# EAGLE schematic Jupiter Ace build023 (EAGLE 9.6.2)
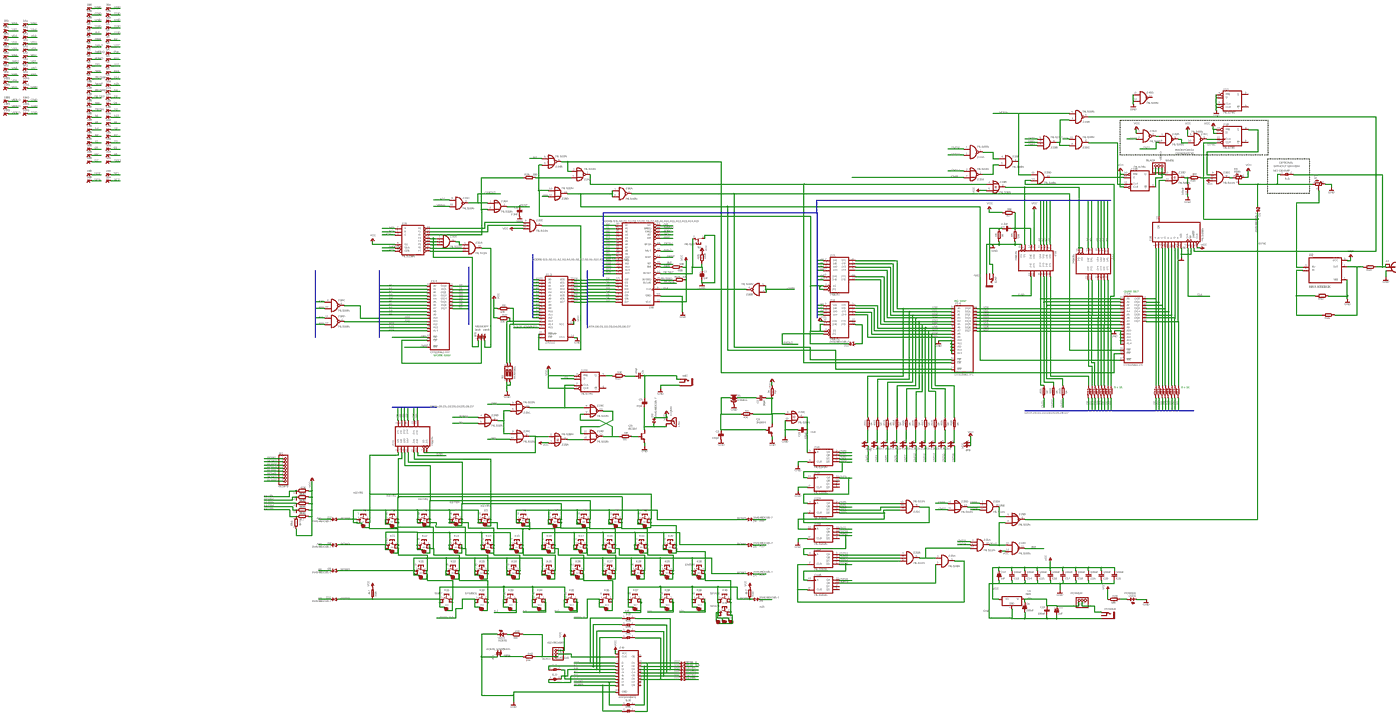
[diagram p0: schematic, sheet 1, overview]
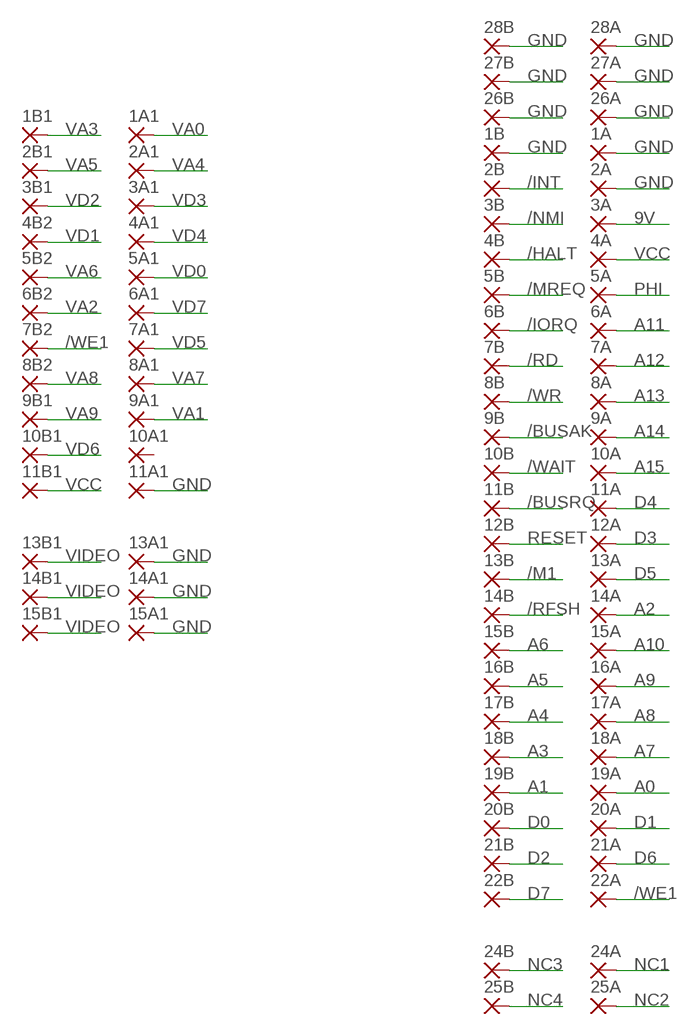
[diagram p1: schematic, sheet 1, part 1 of 5]
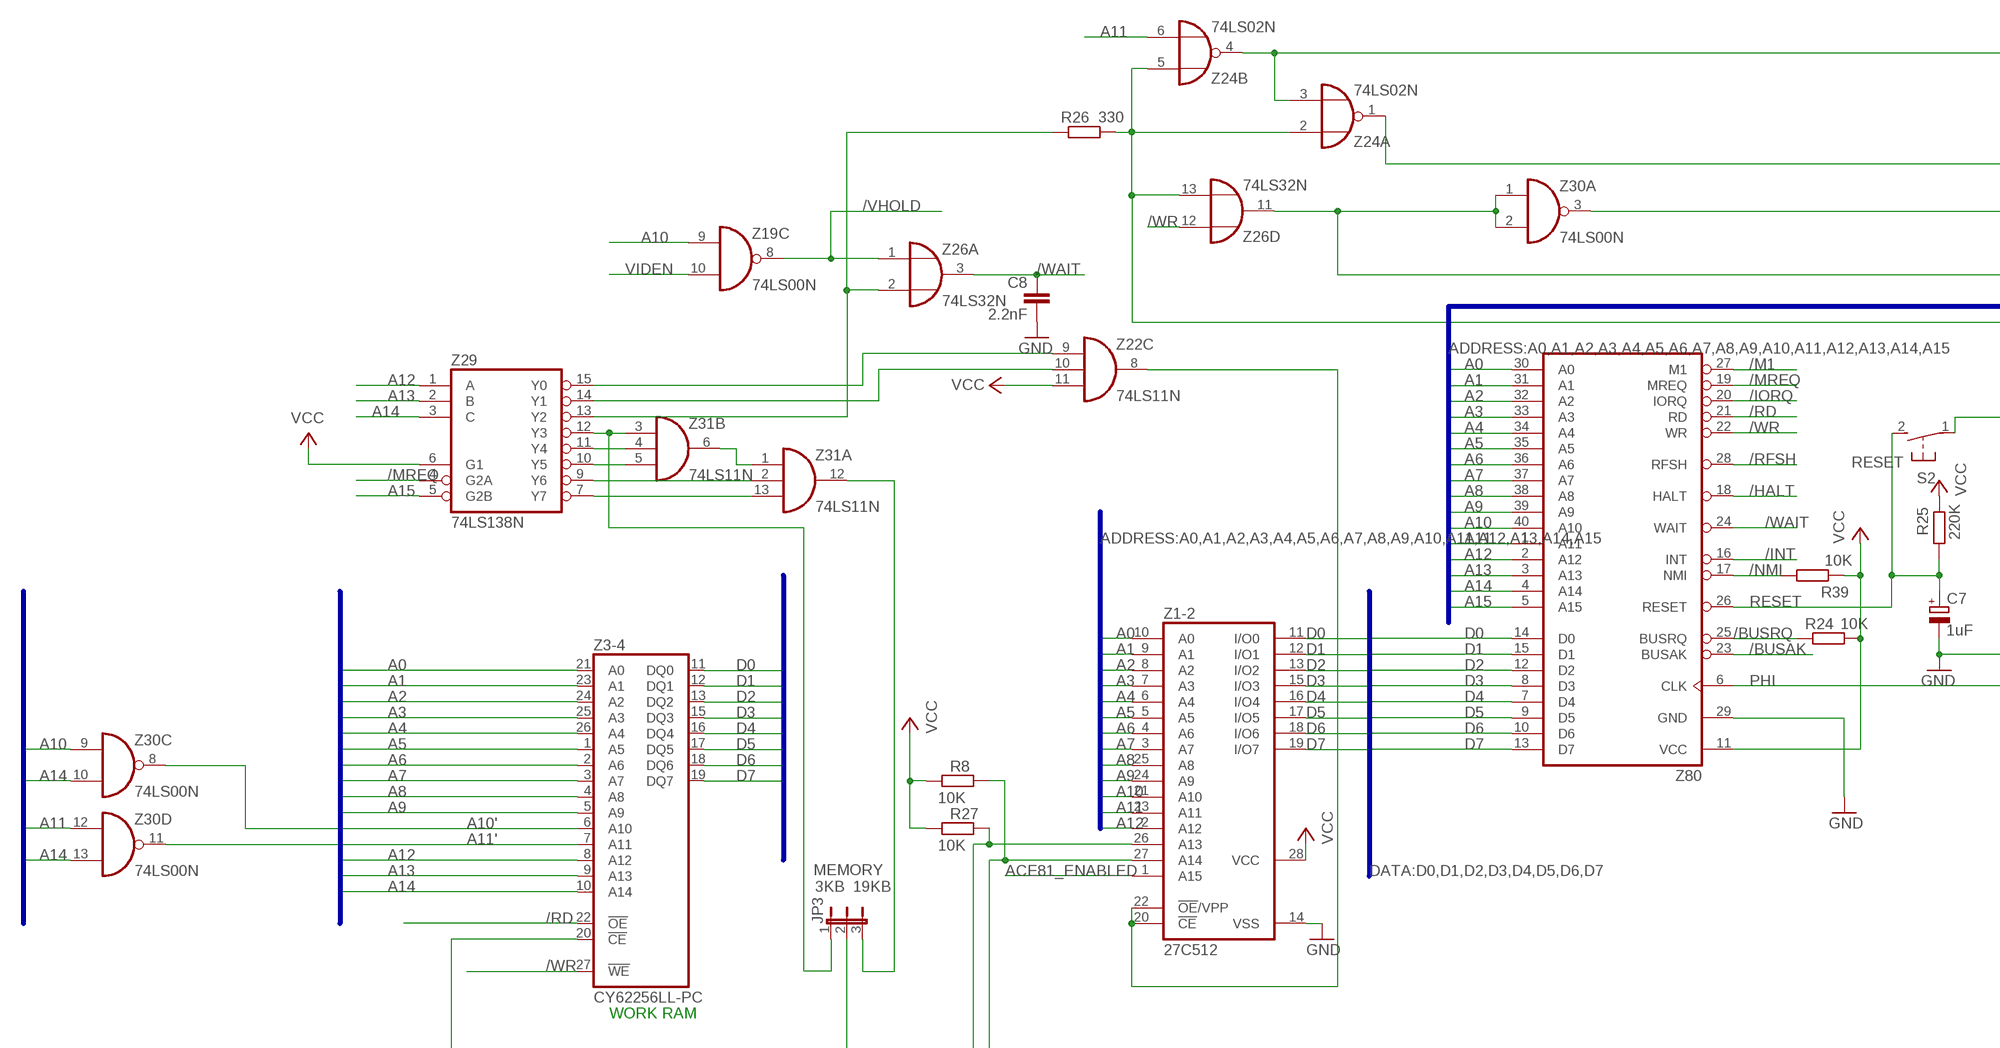
[diagram p2: schematic, sheet 1, part 2 of 5]
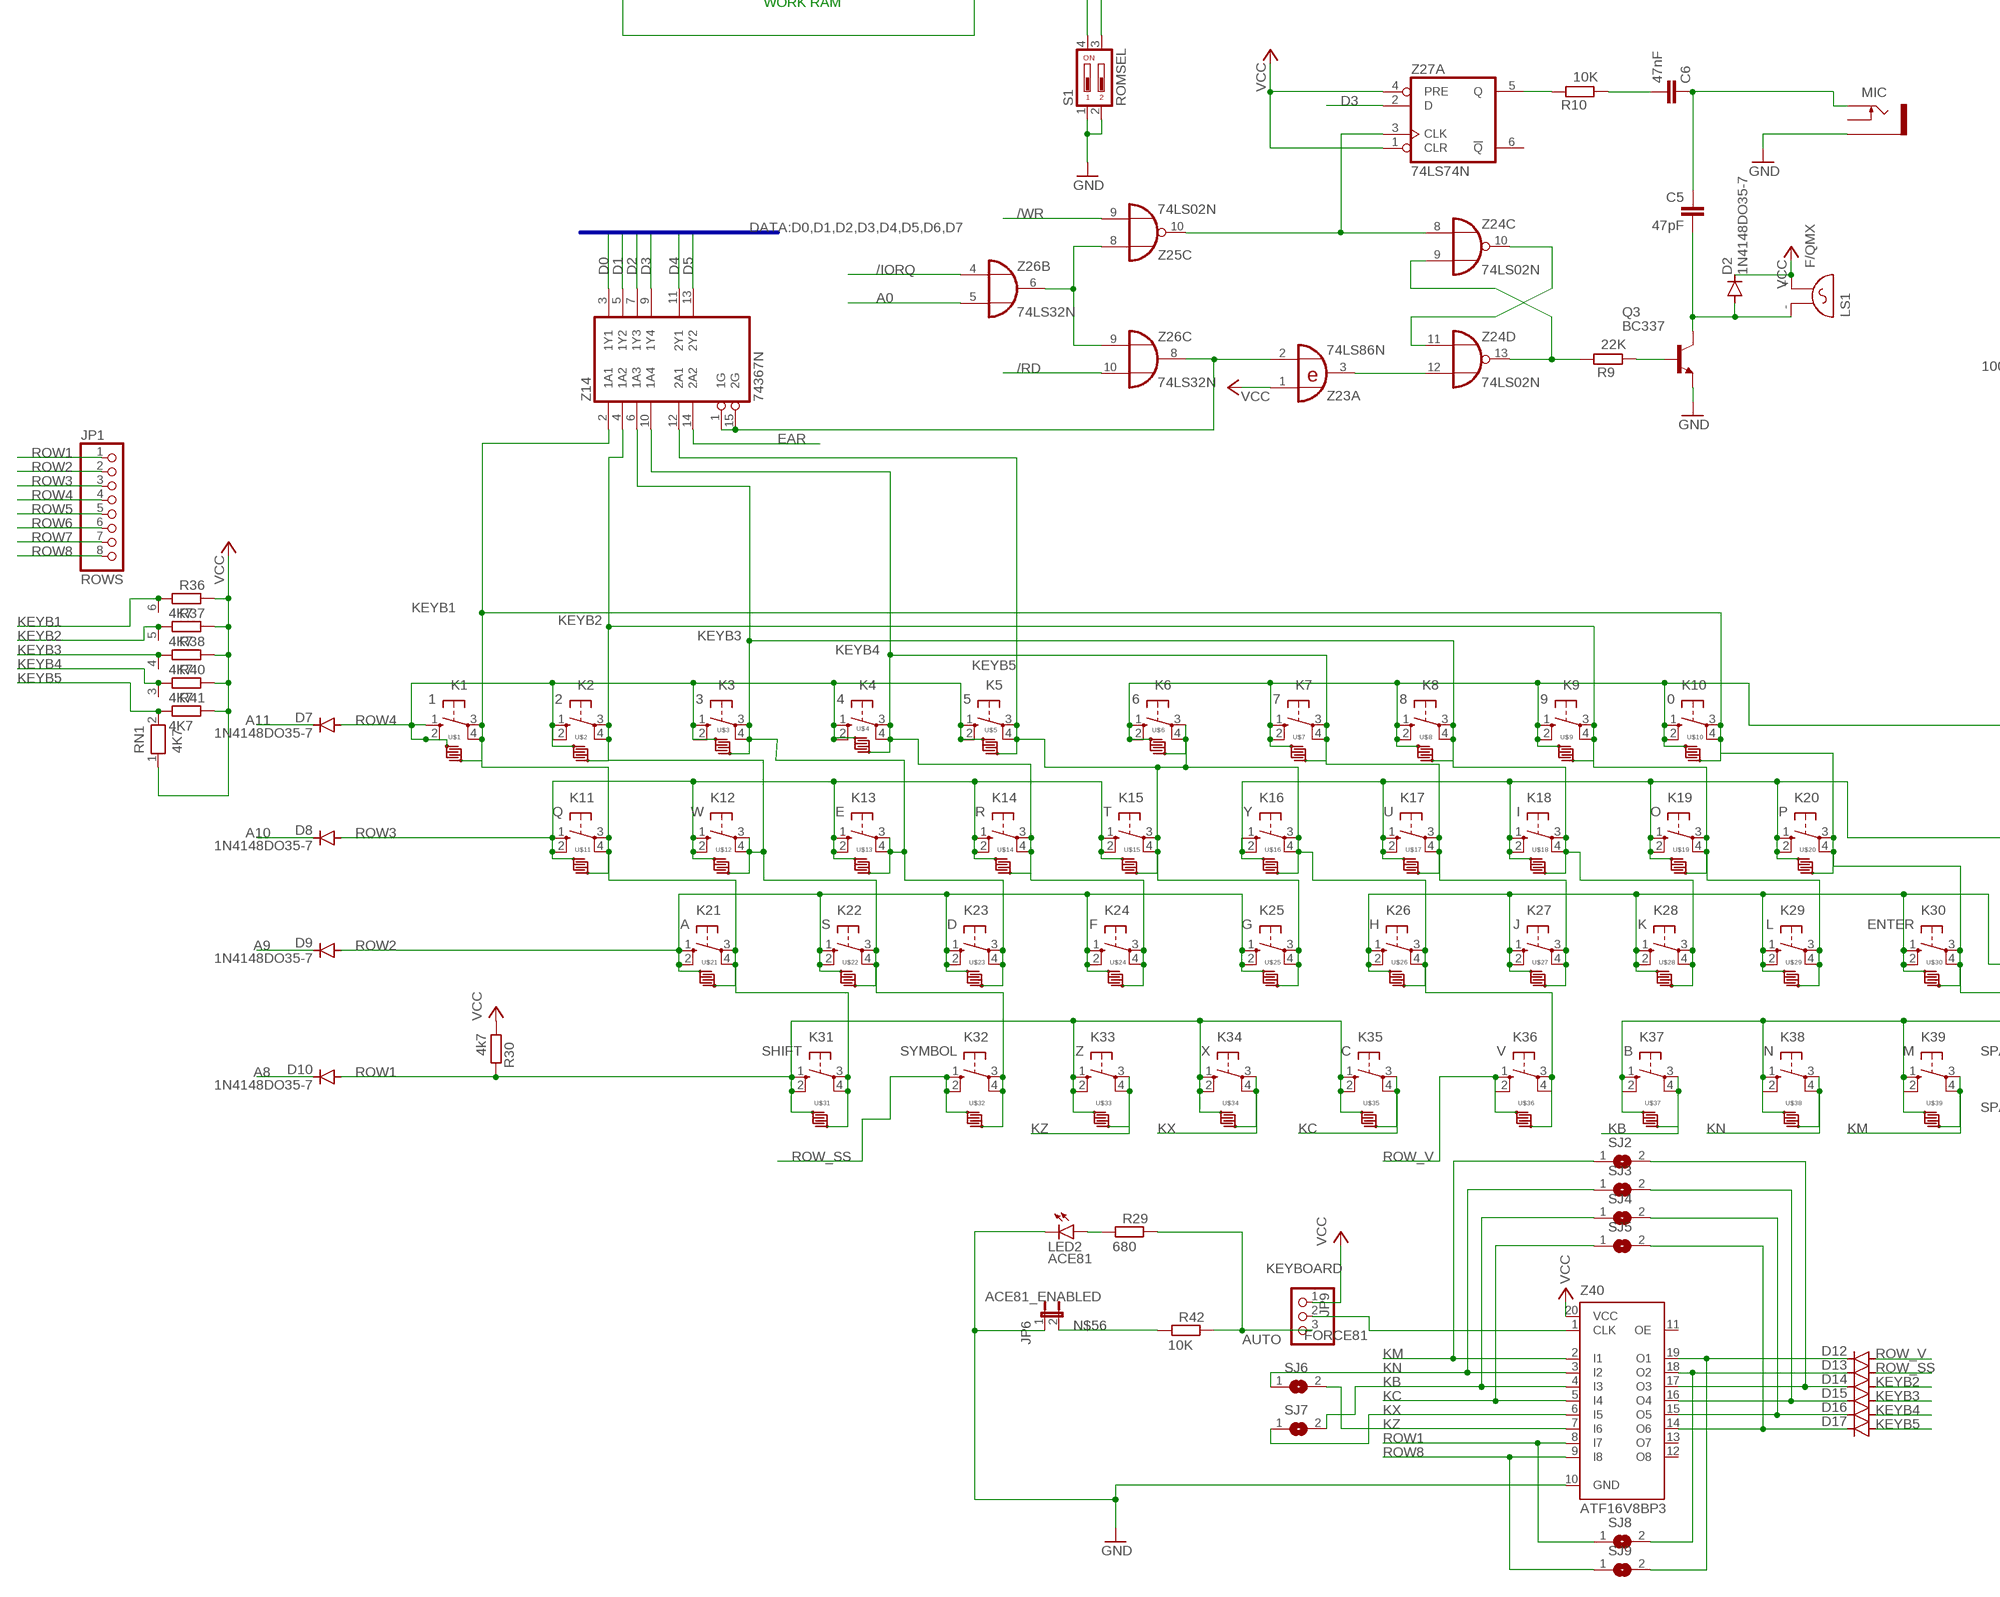
[diagram p3: schematic, sheet 1, part 3 of 5]
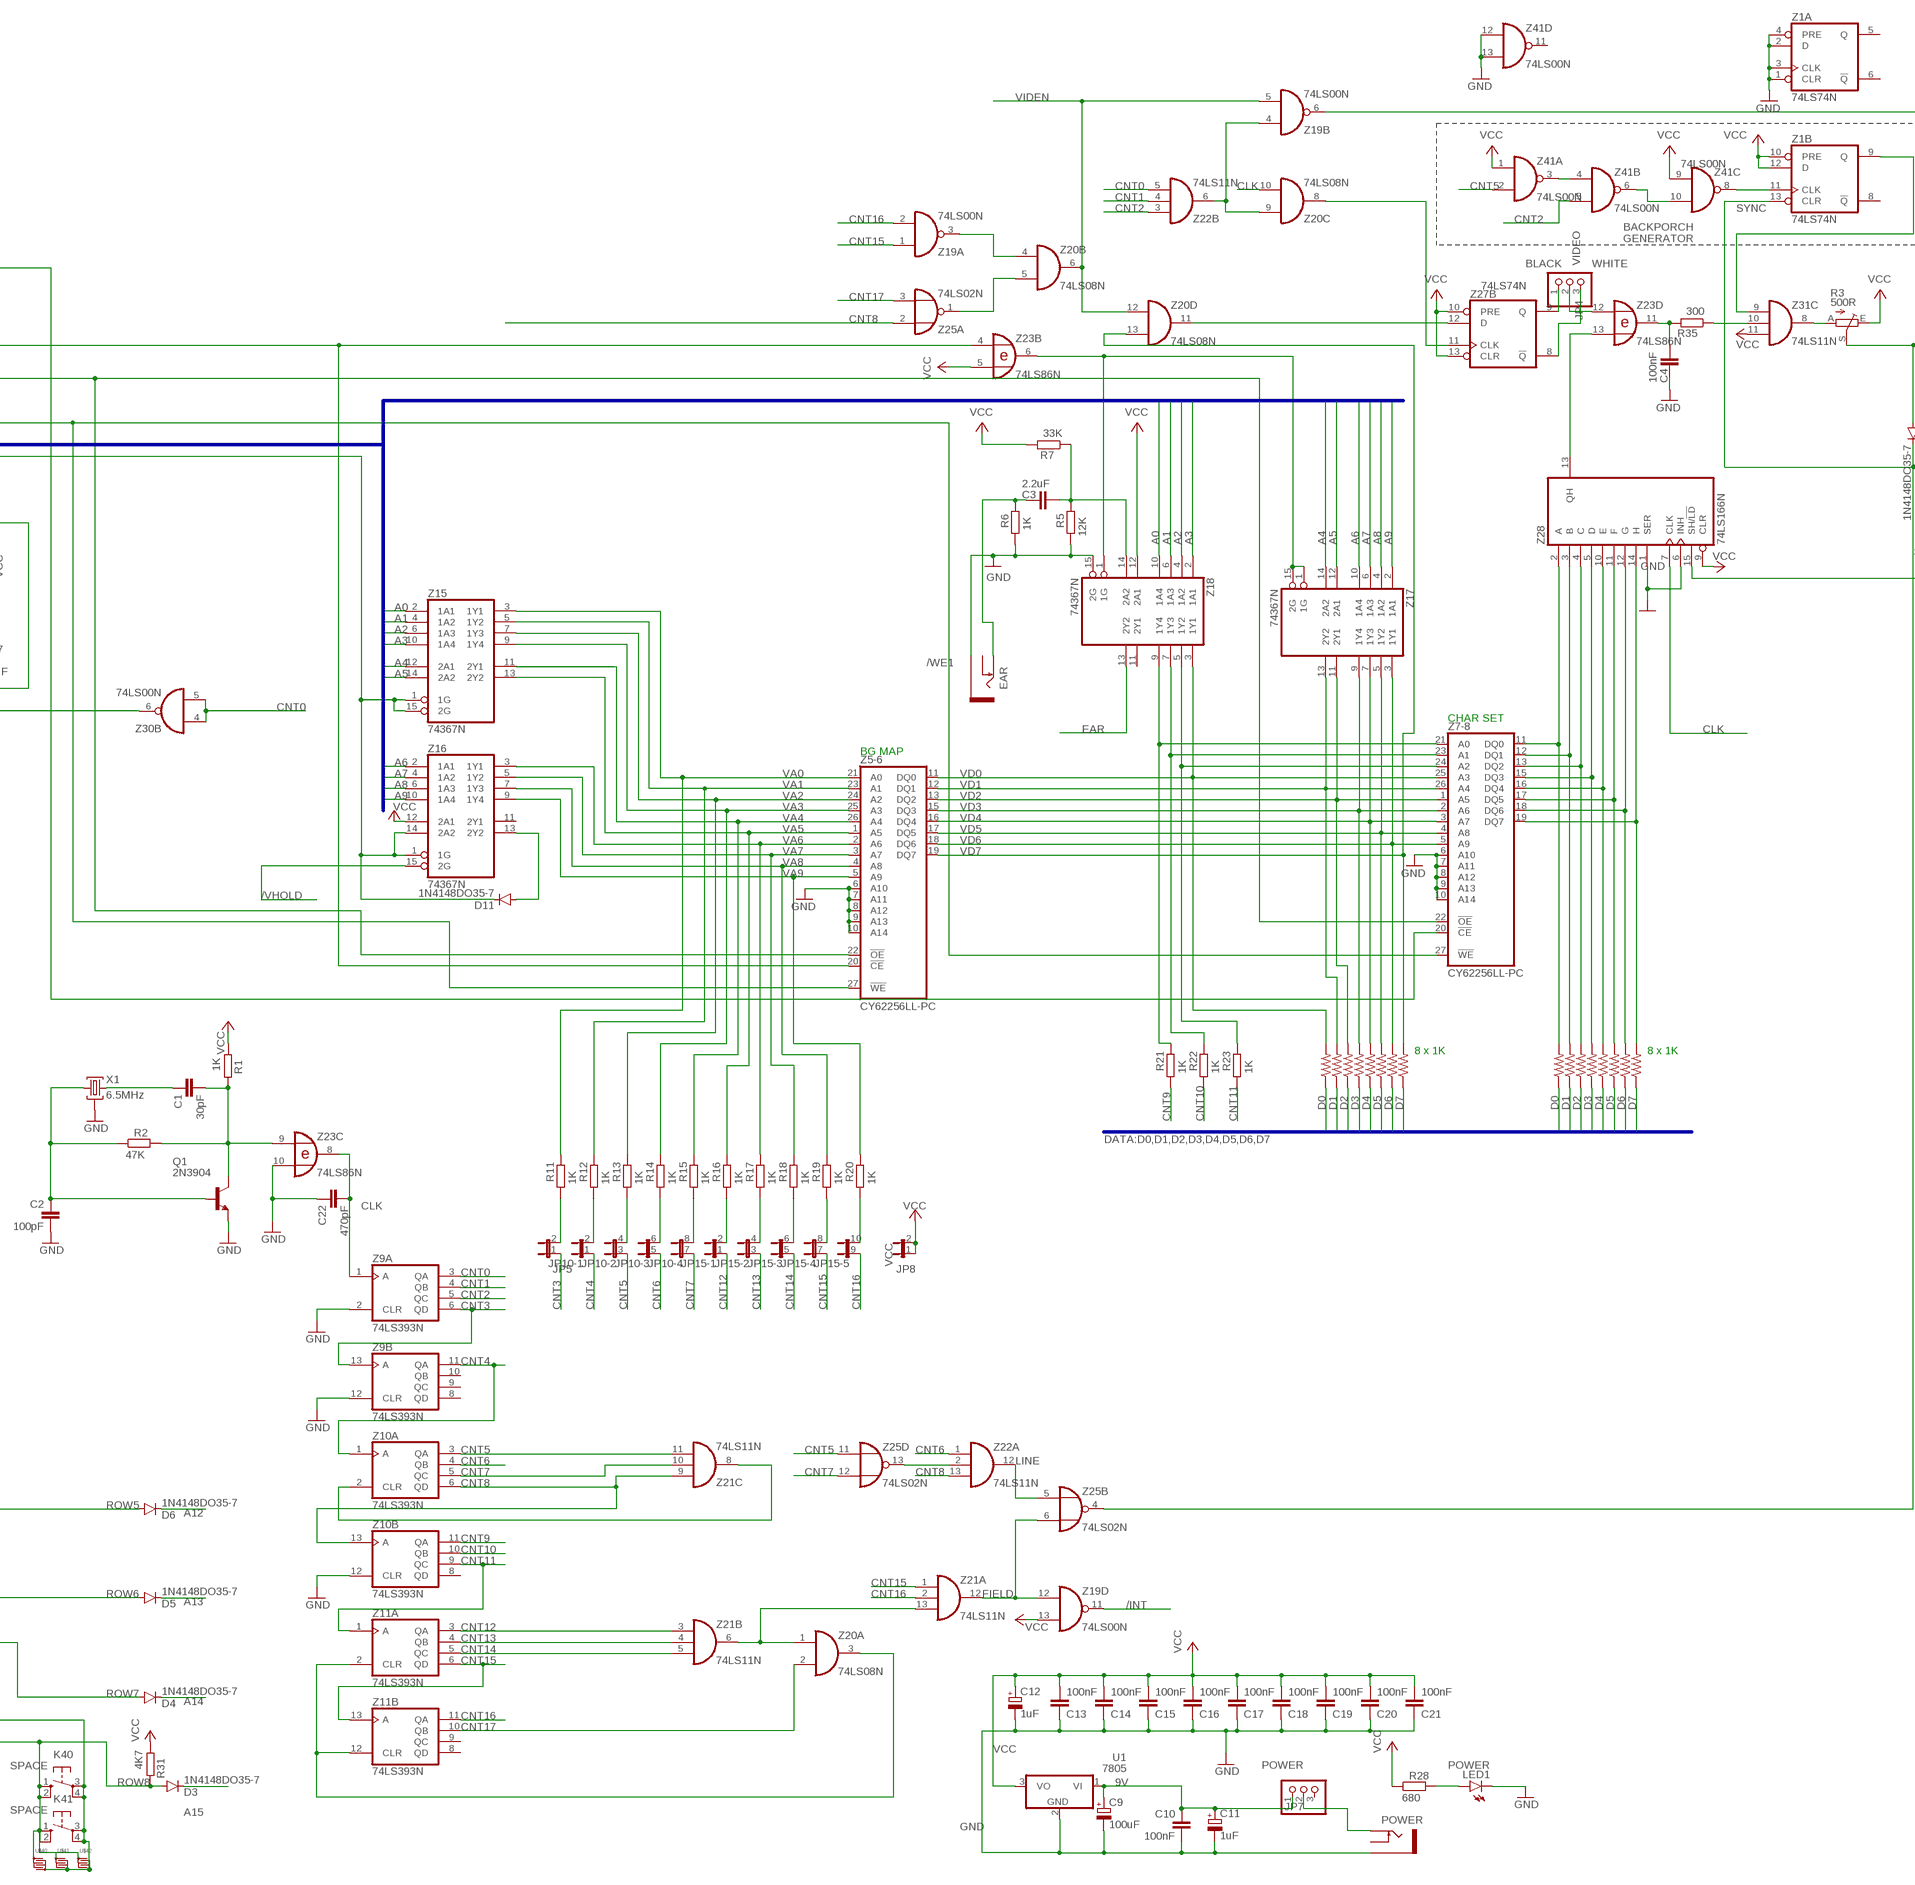
[diagram p4: schematic, sheet 1, part 4 of 5]
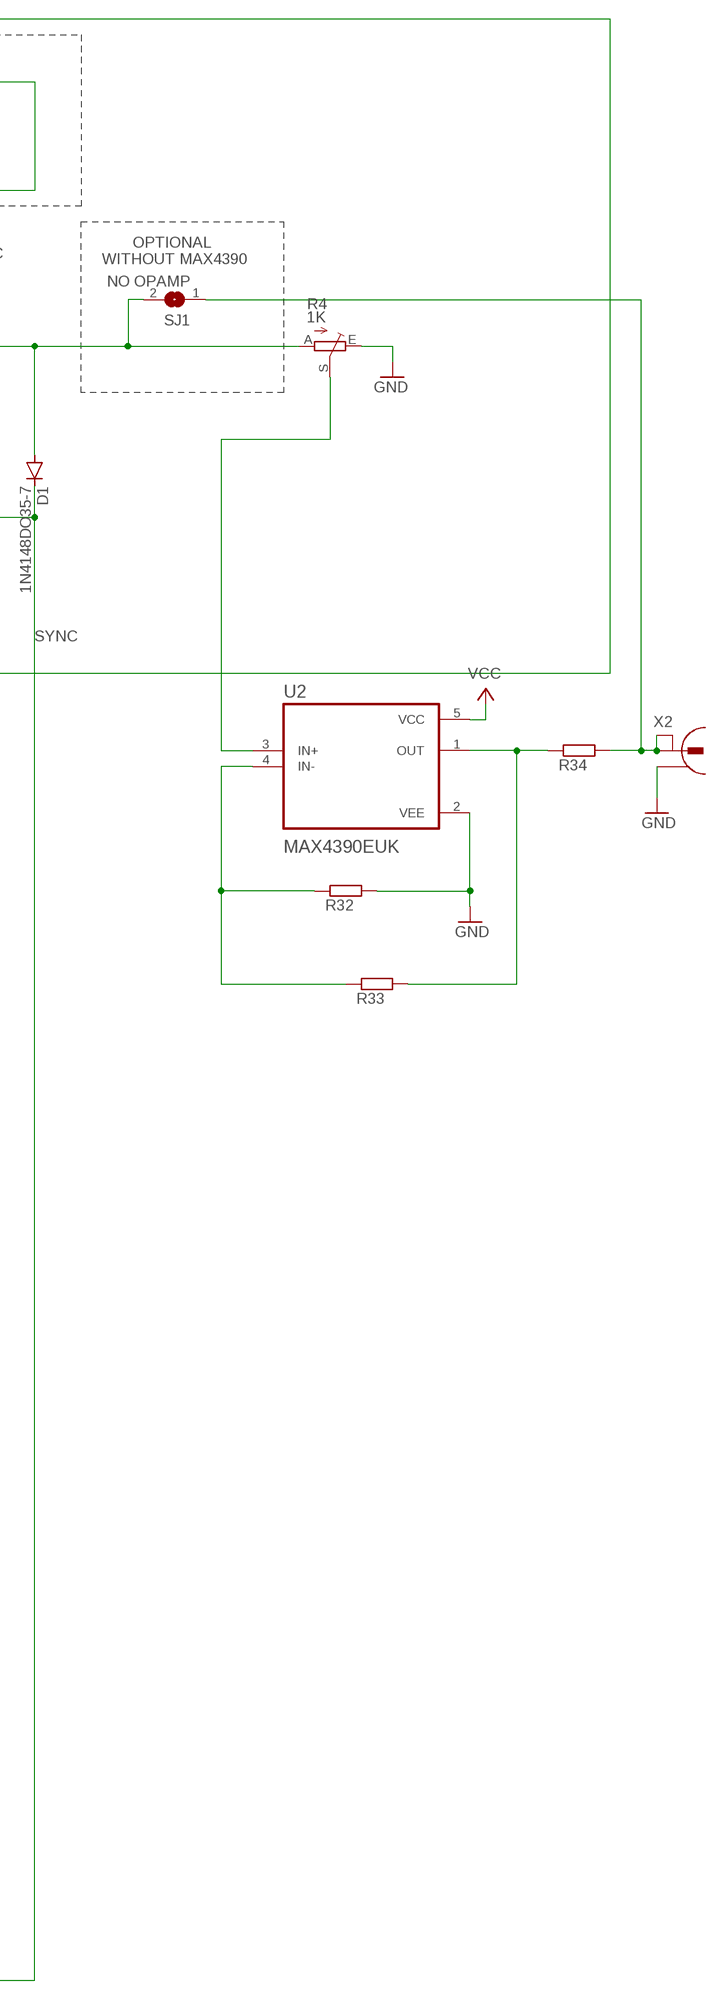
[diagram p5: schematic, sheet 1, part 5 of 5]

## Parts
1A  SMD2EDGEPIN  [EDGEPIN]
1A1  SMD2EDGEPIN  [EDGEPIN]
1B  SMD2EDGEPIN  [EDGEPIN]
1B1  SMD2EDGEPIN  [EDGEPIN]
2A  SMD2EDGEPIN  [EDGEPIN]
2A1  SMD2EDGEPIN  [EDGEPIN]
2B  SMD2EDGEPIN  [EDGEPIN]
2B1  SMD2EDGEPIN  [EDGEPIN]
3A  SMD2EDGEPIN  [EDGEPIN]
3A1  SMD2EDGEPIN  [EDGEPIN]
3B  SMD2EDGEPIN  [EDGEPIN]
3B1  SMD2EDGEPIN  [EDGEPIN]
4A  SMD2EDGEPIN  [EDGEPIN]
4A1  SMD2EDGEPIN  [EDGEPIN]
4B  SMD2EDGEPIN  [EDGEPIN]
4B2  SMD2EDGEPIN  [EDGEPIN]
5A  SMD2EDGEPIN  [EDGEPIN]
5A1  SMD2EDGEPIN  [EDGEPIN]
5B  SMD2EDGEPIN  [EDGEPIN]
5B2  SMD2EDGEPIN  [EDGEPIN]
6A  SMD2EDGEPIN  [EDGEPIN]
6A1  SMD2EDGEPIN  [EDGEPIN]
6B  SMD2EDGEPIN  [EDGEPIN]
6B2  SMD2EDGEPIN  [EDGEPIN]
7A  SMD2EDGEPIN  [EDGEPIN]
7A1  SMD2EDGEPIN  [EDGEPIN]
7B  SMD2EDGEPIN  [EDGEPIN]
7B2  SMD2EDGEPIN  [EDGEPIN]
8A  SMD2EDGEPIN  [EDGEPIN]
8A1  SMD2EDGEPIN  [EDGEPIN]
8B  SMD2EDGEPIN  [EDGEPIN]
8B2  SMD2EDGEPIN  [EDGEPIN]
9A  SMD2EDGEPIN  [EDGEPIN]
9A1  SMD2EDGEPIN  [EDGEPIN]
9B  SMD2EDGEPIN  [EDGEPIN]
9B1  SMD2EDGEPIN  [EDGEPIN]
10A  SMD2EDGEPIN  [EDGEPIN]
10A1  SMD2EDGEPIN  [EDGEPIN]
10B  SMD2EDGEPIN  [EDGEPIN]
10B1  SMD2EDGEPIN  [EDGEPIN]
11A  SMD2EDGEPIN  [EDGEPIN]
11A1  SMD2EDGEPIN  [EDGEPIN]
11B  SMD2EDGEPIN  [EDGEPIN]
11B1  SMD2EDGEPIN  [EDGEPIN]
12A  SMD2EDGEPIN  [EDGEPIN]
12B  SMD2EDGEPIN  [EDGEPIN]
13A  SMD2EDGEPIN  [EDGEPIN]
13A1  SMD2EDGEPIN  [EDGEPIN]
13B  SMD2EDGEPIN  [EDGEPIN]
13B1  SMD2EDGEPIN  [EDGEPIN]
14A  SMD2EDGEPIN  [EDGEPIN]
14A1  SMD2EDGEPIN  [EDGEPIN]
14B  SMD2EDGEPIN  [EDGEPIN]
14B1  SMD2EDGEPIN  [EDGEPIN]
15A  SMD2EDGEPIN  [EDGEPIN]
15A1  SMD2EDGEPIN  [EDGEPIN]
15B  SMD2EDGEPIN  [EDGEPIN]
15B1  SMD2EDGEPIN  [EDGEPIN]
16A  SMD2EDGEPIN  [EDGEPIN]
16B  SMD2EDGEPIN  [EDGEPIN]
17A  SMD2EDGEPIN  [EDGEPIN]
17B  SMD2EDGEPIN  [EDGEPIN]
18A  SMD2EDGEPIN  [EDGEPIN]
18B  SMD2EDGEPIN  [EDGEPIN]
19A  SMD2EDGEPIN  [EDGEPIN]
19B  SMD2EDGEPIN  [EDGEPIN]
20A  SMD2EDGEPIN  [EDGEPIN]
20B  SMD2EDGEPIN  [EDGEPIN]
21A  SMD2EDGEPIN  [EDGEPIN]
21B  SMD2EDGEPIN  [EDGEPIN]
22A  SMD2EDGEPIN  [EDGEPIN]
22B  SMD2EDGEPIN  [EDGEPIN]
24A  SMD2EDGEPIN  [EDGEPIN]
24B  SMD2EDGEPIN  [EDGEPIN]
25A  SMD2EDGEPIN  [EDGEPIN]
25B  SMD2EDGEPIN  [EDGEPIN]
26A  SMD2EDGEPIN  [EDGEPIN]
26B  SMD2EDGEPIN  [EDGEPIN]
27A  SMD2EDGEPIN  [EDGEPIN]
27B  SMD2EDGEPIN  [EDGEPIN]
28A  SMD2EDGEPIN  [EDGEPIN]
28B  SMD2EDGEPIN  [EDGEPIN]
C1  30pF  C-EU025-025X050  [C025-025X050]
C2  100pF  C-EU025-025X050  [C025-025X050]
C3  2.2uF  C-EU025-025X050  [C025-025X050]
C4  100nF  C-EU025-025X050  [C025-025X050]
C5  47pF  C-EU025-025X050  [C025-025X050]
C6  47nF  C-EU025-025X050  [C025-025X050]
C7  1uF  CPOL-EUE1.8-4  [E1,8-4]
C8  2.2nF  C-EU025-025X050  [C025-025X050]
C9  100uF  CPOL-EUE1.8-4  [E1,8-4]
C10  100nF  C-EU025-025X050  [C025-025X050]
C11  1uF  CPOL-EUE1.8-4  [E1,8-4]
C12  1uF  CPOL-EUE1.8-4  [E1,8-4]
C13  100nF  C-EU025-025X050  [C025-025X050]
C14  100nF  C-EU025-025X050  [C025-025X050]
C15  100nF  C-EU025-025X050  [C025-025X050]
C16  100nF  C-EU025-025X050  [C025-025X050]
C17  100nF  C-EU025-025X050  [C025-025X050]
C18  100nF  C-EU025-025X050  [C025-025X050]
C19  100nF  C-EU025-025X050  [C025-025X050]
C20  100nF  C-EU025-025X050  [C025-025X050]
C21  100nF  C-EU025-025X050  [C025-025X050]
C22  470pF  C-EU025-025X050  [C025-025X050]
D1  1N4148DO35-7  [DO35-7]
D2  1N4148DO35-7  [DO35-7]
D3  1N4148DO35-7  [DO35-7]
D4  1N4148DO35-7  [DO35-7]
D5  1N4148DO35-7  [DO35-7]
D6  1N4148DO35-7  [DO35-7]
D7  1N4148DO35-7  [DO35-7]
D8  1N4148DO35-7  [DO35-7]
D9  1N4148DO35-7  [DO35-7]
D10  1N4148DO35-7  [DO35-7]
D11  1N4148DO35-7  [DO35-7]
D12  1N4148DO35-7  [DO35-7]
D13  1N4148DO35-7  [DO35-7]
D14  1N4148DO35-7  [DO35-7]
D15  1N4148DO35-7  [DO35-7]
D16  1N4148DO35-7  [DO35-7]
D17  1N4148DO35-7  [DO35-7]
EAR  PJ302M  [PJ302M]
JP1  ROWS  PINHD-1X8  [1X08]
JP3  MEMORY  JP2E  [JP2]
JP4  VIDEO  PINHD-1X3  [1X03]
JP5  JP1E1Q  [JP1Q]
JP6  ACE81_ENABLED  JP1E1Q  [JP1Q]
JP7  POWER  PINHD-1X3  [1X03]
JP8  VCC  JP1E1Q  [JP1Q]
JP9  KEYBOARD  PINHD-1X3  [1X03]
JP10  JP4QE  [JP4Q]
JP15  JP5QE  [JP5Q]
K1  1  40-XXNOHOLES  [B3F-40XXNOHOLE]
K2  2  40-XXNOHOLES  [B3F-40XXNOHOLE]
K3  3  40-XXNOHOLES  [B3F-40XXNOHOLE]
K4  4  40-XXNOHOLES  [B3F-40XXNOHOLE]
K5  5  40-XXNOHOLES  [B3F-40XXNOHOLE]
K6  6  40-XXNOHOLES  [B3F-40XXNOHOLE]
K7  7  40-XXNOHOLES  [B3F-40XXNOHOLE]
K8  8  40-XXNOHOLES  [B3F-40XXNOHOLE]
K9  9  40-XXNOHOLES  [B3F-40XXNOHOLE]
K10  0  40-XXNOHOLES  [B3F-40XXNOHOLE]
K11  Q  40-XXNOHOLES  [B3F-40XXNOHOLE]
K12  W  40-XXNOHOLES  [B3F-40XXNOHOLE]
K13  E  40-XXNOHOLES  [B3F-40XXNOHOLE]
K14  R  40-XXNOHOLES  [B3F-40XXNOHOLE]
K15  T  40-XXNOHOLES  [B3F-40XXNOHOLE]
K16  Y  40-XXNOHOLES  [B3F-40XXNOHOLE]
K17  U  40-XXNOHOLES  [B3F-40XXNOHOLE]
K18  I  40-XXNOHOLES  [B3F-40XXNOHOLE]
K19  O  40-XXNOHOLES  [B3F-40XXNOHOLE]
K20  P  40-XXNOHOLES  [B3F-40XXNOHOLE]
K21  A  40-XXNOHOLES  [B3F-40XXNOHOLE]
K22  S  40-XXNOHOLES  [B3F-40XXNOHOLE]
K23  D  40-XXNOHOLES  [B3F-40XXNOHOLE]
K24  F  40-XXNOHOLES  [B3F-40XXNOHOLE]
K25  G  40-XXNOHOLES  [B3F-40XXNOHOLE]
K26  H  40-XXNOHOLES  [B3F-40XXNOHOLE]
K27  J  40-XXNOHOLES  [B3F-40XXNOHOLE]
K28  K  40-XXNOHOLES  [B3F-40XXNOHOLE]
K29  L  40-XXNOHOLES  [B3F-40XXNOHOLE]
K30  ENTER  40-XXNOHOLES  [B3F-40XXNOHOLE]
K31  SHIFT  40-XXNOHOLES  [B3F-40XXNOHOLE]
K32  SYMBOL  40-XXNOHOLES  [B3F-40XXNOHOLE]
K33  Z  40-XXNOHOLES  [B3F-40XXNOHOLE]
K34  X  40-XXNOHOLES  [B3F-40XXNOHOLE]
K35  C  40-XXNOHOLES  [B3F-40XXNOHOLE]
K36  V  40-XXNOHOLES  [B3F-40XXNOHOLE]
K37  B  40-XXNOHOLES  [B3F-40XXNOHOLE]
K38  N  40-XXNOHOLES  [B3F-40XXNOHOLE]
K39  M  40-XXNOHOLES  [B3F-40XXNOHOLE]
K40  SPACE  40-XXNOHOLES  [B3F-40XXNOHOLE]
K41  SPACE  40-XXNOHOLES  [B3F-40XXNOHOLE]
LED1  POWER  LED3MM  [LED3MM]
LED2  ACE81  LED3MM  [LED3MM]
LS1  F/QMX  [F/QMX]
MIC  PJ302M  [PJ302M]
POWER  PJ302M  [PJ302M]
Q1  2N3904  [TO92]
Q3  BC337  [TO92]
R1  1K  R-EU_0204/7  [0204/7]
R2  47K  R-EU_0204/7  [0204/7]
R3  500R  TRIM_EU-B25P  [B25P]
R4  1K  TRIM_EU-B25P  [B25P]
R5  12K  R-EU_0204/7  [0204/7]
R6  1K  R-EU_0204/7  [0204/7]
R7  33K  R-EU_0204/7  [0204/7]
R8  10K  R-EU_0204/7  [0204/7]
R9  22K  R-EU_0204/7  [0204/7]
R10  10K  R-EU_0204/7  [0204/7]
R11  1K  R-EU_0204/7  [0204/7]
R12  1K  R-EU_0204/7  [0204/7]
R13  1K  R-EU_0204/7  [0204/7]
R14  1K  R-EU_0204/7  [0204/7]
R15  1K  R-EU_0204/7  [0204/7]
R16  1K  R-EU_0204/7  [0204/7]
R17  1K  R-EU_0204/7  [0204/7]
R18  1K  R-EU_0204/7  [0204/7]
R19  1K  R-EU_0204/7  [0204/7]
R20  1K  R-EU_0204/7  [0204/7]
R21  1K  R-EU_0204/7  [0204/7]
R22  1K  R-EU_0204/7  [0204/7]
R23  1K  R-EU_0204/7  [0204/7]
R24  10K  R-EU_0204/7  [0204/7]
R25  220K  R-EU_0204/7  [0204/7]
R26  330  R-EU_0204/7  [0204/7]
R27  10K  R-EU_0204/7  [0204/7]
R28  680  R-EU_0204/7  [0204/7]
R29  680  R-EU_0204/7  [0204/7]
R30  4k7  R-EU_0204/7  [0204/7]
R31  4K7  R-EU_0204/7  [0204/7]
R32  R-EU_0204/7  [0204/7]
R33  R-EU_0204/7  [0204/7]
R34  R-EU_0204/7  [0204/7]
R35  300  R-EU_0204/7  [0204/7]
R36  4K7  R-EU_0207/10  [0207/10]
R37  4K7  R-EU_0207/10  [0207/10]
R38  4K7  R-EU_0207/10  [0207/10]
R39  10K  R-EU_0204/7  [0204/7]
R40  4K7  R-EU_0207/10  [0207/10]
R41  4K7  R-EU_0207/10  [0207/10]
R42  10K  R-EU_0204/7  [0204/7]
R100  1K  R-US_0204/2V  [0204V]
R101  1K  R-US_0204/2V  [0204V]
R102  1K  R-US_0204/2V  [0204V]
R103  1K  R-US_0204/2V  [0204V]
R104  1K  R-US_0204/2V  [0204V]
R105  1K  R-US_0204/2V  [0204V]
R106  1K  R-US_0204/2V  [0204V]
R107  1K  R-US_0204/2V  [0204V]
R200  1K  R-US_0204/2V  [0204V]
R201  1K  R-US_0204/2V  [0204V]
R202  1K  R-US_0204/2V  [0204V]
R203  1K  R-US_0204/2V  [0204V]
R204  1K  R-US_0204/2V  [0204V]
R205  1K  R-US_0204/2V  [0204V]
R206  1K  R-US_0204/2V  [0204V]
R207  1K  R-US_0204/2V  [0204V]
RN1  4K7  RN05  [RN-6]
S1  ROMSEL  DS02  [DS-02]
S2  RESET  31-XX  [B3F-31XX]
SJ1  NO OPAMP  SJ  [SJ]
SJ2  SJ  [SJ]
SJ3  SJ  [SJ]
SJ4  SJ  [SJ]
SJ5  SJ  [SJ]
SJ6  SJ  [SJ]
SJ7  SJ  [SJ]
SJ8  SJ  [SJ]
SJ9  SJ  [SJ]
U1  7805  7805TV  [TO220V]
U2  MAX4390EUK  [SOT95P280X145-5N]
U$1  40-XX-CARBON  [CARBONB3F]
U$2  40-XX-CARBON  [CARBONB3F]
U$3  40-XX-CARBON  [CARBONB3F]
U$4  40-XX-CARBON  [CARBONB3F]
U$5  40-XX-CARBON  [CARBONB3F]
U$6  40-XX-CARBON  [CARBONB3F]
U$7  40-XX-CARBON  [CARBONB3F]
U$8  40-XX-CARBON  [CARBONB3F]
U$9  40-XX-CARBON  [CARBONB3F]
U$10  40-XX-CARBON  [CARBONB3F]
U$11  40-XX-CARBON  [CARBONB3F]
U$12  40-XX-CARBON  [CARBONB3F]
U$13  40-XX-CARBON  [CARBONB3F]
U$14  40-XX-CARBON  [CARBONB3F]
U$15  40-XX-CARBON  [CARBONB3F]
U$16  40-XX-CARBON  [CARBONB3F]
U$17  40-XX-CARBON  [CARBONB3F]
U$18  40-XX-CARBON  [CARBONB3F]
U$19  40-XX-CARBON  [CARBONB3F]
U$20  40-XX-CARBON  [CARBONB3F]
U$21  40-XX-CARBON  [CARBONB3F]
U$22  40-XX-CARBON  [CARBONB3F]
U$23  40-XX-CARBON  [CARBONB3F]
U$24  40-XX-CARBON  [CARBONB3F]
U$25  40-XX-CARBON  [CARBONB3F]
U$26  40-XX-CARBON  [CARBONB3F]
U$27  40-XX-CARBON  [CARBONB3F]
U$28  40-XX-CARBON  [CARBONB3F]
U$29  40-XX-CARBON  [CARBONB3F]
U$30  40-XX-CARBON  [CARBONB3F]
U$31  40-XX-CARBON  [CARBONB3F]
U$32  40-XX-CARBON  [CARBONB3F]
U$33  40-XX-CARBON  [CARBONB3F]
U$34  40-XX-CARBON  [CARBONB3F]
U$35  40-XX-CARBON  [CARBONB3F]
U$36  40-XX-CARBON  [CARBONB3F]
U$37  40-XX-CARBON  [CARBONB3F]
U$38  40-XX-CARBON  [CARBONB3F]
U$39  40-XX-CARBON  [CARBONB3F]
U$40  40-XX-CARBON  [CARBONB3F]
U$41  40-XX-CARBON  [CARBONB3F]
U$42  40-XX-CARBON  [CARBONB3F]
X1  6.5MHz  8M10AHC49T  [HC49U]
X2  CON-CONRAD_736880-49  [CON-CONRAD_736880-49]
Z0  Z80  Z80CPU  [DIL40]
Z1  74LS74N  [DIL14]
Z1-2  27C512  27512G  [DIL28-6]
Z3-4  CY62256LL-PC  [DIL28-6]
Z5-6  CY62256LL-PC  [DIL28-6]
Z7-8  CY62256LL-PC  [DIL28-6]
Z9  74LS393N  [DIL14]
Z10  74LS393N  [DIL14]
Z11  74LS393N  [DIL14]
Z14  74367N  [DIL16]
Z15  74367N  [DIL16]
Z16  74367N  [DIL16]
Z17  74367N  [DIL16]
Z18  74367N  [DIL16]
Z19  74LS00N  [DIL14]
Z20  74LS08N  [DIL14]
Z21  74LS11N  [DIL14]
Z22  74LS11N  [DIL14]
Z23  74LS86N  [DIL14]
Z24  74LS02N  [DIL14]
Z25  74LS02N  [DIL14]
Z26  74LS32N  [DIL14]
Z27  74LS74N  [DIL14]
Z28  74LS166N  [DIL16]
Z29  74LS138N  [DIL16]
Z30  74LS00N  [DIL14]
Z31  74LS11N  [DIL14]
Z40  ATF16V8BP3  [DIL20]
Z41  74LS00N  [DIL14]

## Nets
9V: 3A.1(P) C9.+ C10.1 C11.+ JP7.1 U1.1(VI)
/BUSAK: 9B.1(P) Z0.23(BUSAK)
/BUSRQ: 11B.1(P) R24.1 Z0.25(BUSRQ)
/HALT: 4B.1(P) Z0.18(HALT)
/INT: 2B.1(P) Z0.16(INT) Z19.11(D:O)
/IORQ: 6B.1(P) Z0.20(IORQ) Z26.4(B:I0)
/M1: 13B.1(P) Z0.27(M1)
/MREQ: 5B.1(P) Z0.19(MREQ) Z29.4(G2A)
/NMI: 3B.1(P) R39.1 Z0.17(NMI)
/RD: 7B.1(P) Z0.21(RD) Z3-4.22(!OE) Z26.10(C:I1)
/RFSH: 14B.1(P) Z0.28(RFSH)
/VHOLD: Z16.15(2G) Z19.8(C:O) Z26.1(A:I0)
/WAIT: 10B.1(P) C8.1 Z0.24(WAIT) Z26.3(A:O)
/WE1: 7B2.1(P) 22A.1(P) Z5-6.27(!WE) Z7-8.27(!WE) Z26.11(D:O) Z30.1(A:I0) Z30.2(A:I1)
/WR: 8B.1(P) Z0.22(WR) Z3-4.27(!WE) Z25.9(C:I1) Z26.12(D:I0)
A0: 19A.1(P) Z0.30(A0) Z1-2.10(A0) Z3-4.21(A0) Z15.2(1A1) Z18.10(1A4) Z26.5(B:I1)
A1: 19B.1(P) Z0.31(A1) Z1-2.9(A1) Z3-4.23(A1) Z15.4(1A2) Z18.6(1A3)
A2: 14A.1(P) Z0.32(A2) Z1-2.8(A2) Z3-4.24(A2) Z15.6(1A3) Z18.4(1A2)
A3: 18B.1(P) Z0.33(A3) Z1-2.7(A3) Z3-4.25(A3) Z15.10(1A4) Z18.2(1A1)
A4: 17B.1(P) Z0.34(A4) Z1-2.6(A4) Z3-4.26(A4) Z15.12(2A1) Z17.14(2A2)
A5: 16B.1(P) Z0.35(A5) Z1-2.5(A5) Z3-4.1(A5) Z15.14(2A2) Z17.12(2A1)
A6: 15B.1(P) Z0.36(A6) Z1-2.4(A6) Z3-4.2(A6) Z16.2(1A1) Z17.10(1A4)
A7: 18A.1(P) Z0.37(A7) Z1-2.3(A7) Z3-4.3(A7) Z16.4(1A2) Z17.6(1A3)
A8: 17A.1(P) D10.C Z0.38(A8) Z1-2.25(A8) Z3-4.4(A8) Z16.6(1A3) Z17.4(1A2)
A9: 16A.1(P) D9.C Z0.39(A9) Z1-2.24(A9) Z3-4.5(A9) Z16.10(1A4) Z17.2(1A1)
A10: 15A.1(P) D8.C Z0.40(A10) Z1-2.21(A10) Z19.9(C:I0) Z30.9(C:I0)
A10': Z3-4.6(A10) Z30.8(C:O)
A11: 6A.1(P) D7.C Z0.1(A11) Z1-2.23(A11) Z24.6(B:I1) Z30.12(D:I0)
A11': Z3-4.7(A11) Z30.11(D:O)
A12: 7A.1(P) D6.C Z0.2(A12) Z1-2.2(A12) Z3-4.8(A12) Z29.1(A)
A13: 8A.1(P) D5.C Z0.3(A13) Z3-4.9(A13) Z29.2(B)
A14: 9A.1(P) D4.C Z0.4(A14) Z3-4.10(A14) Z29.3(C) Z30.10(C:I1) Z30.13(D:I1)
A15: 10A.1(P) D3.C Z0.5(A15) Z29.5(G2B)
ACE81_ENABLED: JP9.3 R29.2 R42.2 Z1-2.1(A15)
AMPLIF_IN: R4.S U2.3(IN+)
AMPLIF_OUT: R33.1 R34.2 U2.1(OUT)
CLK: C22.2 Z9.1(A:A) Z20.10(C:I1) Z23.8(C:O) Z28.7(CLK)
CNT0: Z9.3(A:QA) Z22.5(B:I2) Z30.4(B:I0) Z30.5(B:I1)
CNT1: Z9.4(A:QB) Z22.4(B:I1)
CNT2: Z9.5(A:QC) Z22.3(B:I0) Z41.5(B:I1)
CNT3: JP5.1 Z9.6(A:QD) Z9.13(B:A)
CNT4: JP10.1 Z9.11(B:QA) Z10.1(A:A)
CNT5: JP10.3 Z10.3(A:QA) Z21.11(C:I2) Z25.11(D:I0) Z41.2(A:I1)
CNT6: JP10.5 Z10.4(A:QB) Z22.1(A:I0)
CNT7: JP10.7 Z10.5(A:QC) Z21.10(C:I1) Z25.12(D:I1)
CNT8: Z10.6(A:QD) Z10.13(B:A) Z21.9(C:I0) Z22.13(A:I2) Z25.2(A:I0)
CNT9: R21.1 Z10.11(B:QA)
CNT10: R22.1 Z10.10(B:QB)
CNT11: R23.1 Z10.9(B:QC) Z11.1(A:A)
CNT12: JP15.1 Z11.3(A:QA) Z21.3(B:I0)
CNT13: JP15.3 Z11.4(A:QB) Z21.4(B:I1)
CNT14: JP15.5 Z11.5(A:QC) Z21.5(B:I2)
CNT15: JP15.7 Z11.6(A:QD) Z11.13(B:A) Z19.1(A:I0) Z21.1(A:I0)
CNT16: JP15.9 Z11.11(B:QA) Z19.2(A:I1) Z21.2(A:I1)
CNT17: Z11.10(B:QB) Z20.2(A:I1) Z25.3(A:I1)
D0: 20B.1(P) R100.1 R200.1 Z0.14(D0) Z1-2.11(I/O0) Z3-4.11(DQ0) Z14.3(1Y1)
D1: 20A.1(P) R101.1 R201.1 Z0.15(D1) Z1-2.12(I/O1) Z3-4.12(DQ1) Z14.5(1Y2)
D2: 21B.1(P) R102.1 R202.1 Z0.12(D2) Z1-2.13(I/O2) Z3-4.13(DQ2) Z14.7(1Y3)
D3: 12A.1(P) R103.1 R203.1 Z0.8(D3) Z1-2.15(I/O3) Z3-4.15(DQ3) Z14.9(1Y4) Z27.2(A:D)
D4: 11A.1(P) R104.1 R204.1 Z0.7(D4) Z1-2.16(I/O4) Z3-4.16(DQ4) Z14.11(2Y1)
D5: 13A.1(P) R105.1 R205.1 Z0.9(D5) Z1-2.17(I/O5) Z3-4.17(DQ5) Z14.13(2Y2)
D6: 21A.1(P) R106.1 R206.1 Z0.10(D6) Z1-2.18(I/O6) Z3-4.18(DQ6)
D7: 22B.1(P) R107.1 R207.1 Z0.13(D7) Z1-2.19(I/O7) Z3-4.19(DQ7)
EAR: Z14.14(2A2) Z18.13(2Y2)
FIELD: Z19.12(D:I0) Z21.12(A:O) Z25.6(B:I1)
GND [power]: 1A.1(P) 1B.1(P) 2A.1(P) 11A1.1(P) 13A1.1(P) 14A1.1(P) 15A1.1(P) 26A.1(P) 26B.1(P) 27A.1(P) 27B.1(P) 28A.1(P) 28B.1(P) C2.2 C4.1 C7.- C8.2 C9.- C10.2 C11.- C12.- C13.1 C14.1 C15.1 C16.1 C17.1 C18.1 C19.1 C20.1 C21.1 C22.1 EAR.GND(SLEEVE) JP6.1 LED1.K(C) LED2.K(C) MIC.GND(SLEEVE) POWER.GND(SLEEVE) Q1.3(E) Q3.1(E) R4.E R5.1 R6.1 R32.1 S1.1 S1.2 S2.1(P) U1.2(GND) U2.2(VEE) X1.2 X2.1 Z0.29(GND) Z1-2.14(VSS) Z1.1(A:CLR) Z1.2(A:D) Z1.3(A:CLK) Z1.4(A:PRE) Z5-6.6(A10) Z5-6.7(A11) Z5-6.8(A12) Z5-6.9(A13) Z5-6.10(A14) Z7-8.6(A10) Z7-8.7(A11) Z7-8.8(A12) Z7-8.9(A13) Z7-8.10(A14) Z9.2(A:CLR) Z9.12(B:CLR) Z10.12(B:CLR) Z18.15(2G) Z23.10(C:I1) Z28.1(SER) Z28.6(INH) Z40.10(GND) Z41.12(D:I0) Z41.13(D:I1)
KB: K37.3(P) K37.4(P1) SJ4.1 SJ7.2 U$37.P$2 Z40.4(I3)
KC: K35.3(P) K35.4(P1) SJ5.1 U$35.P$2 Z40.5(I4)
KEYB1: K1.3(P) K1.4(P1) K10.3(P) K10.4(P1) K11.3(P) K11.4(P1) K20.3(P) K20.4(P1) K21.3(P) K21.4(P1) K30.3(P) K30.4(P1) K31.3(P) K31.4(P1) K40.3(P) K40.4(P1) K41.3(P) K41.4(P1) R36.1 RN1.6 U$1.P$2 U$10.P$2 U$11.P$2 U$20.P$2 U$21.P$2 U$30.P$2 U$31.P$2 U$40.P$2 U$41.P$2 U$42.P$2 Z14.2(1A1)
KEYB2: D14.A K2.3(P) K2.4(P1) K9.3(P) K9.4(P1) K12.3(P) K12.4(P1) K19.3(P) K19.4(P1) K22.3(P) K22.4(P1) K29.3(P) K29.4(P1) K32.3(P) K32.4(P1) R37.1 RN1.5 U$2.P$2 U$9.P$2 U$12.P$2 U$19.P$2 U$22.P$2 U$29.P$2 U$32.P$2 Z14.4(1A2)
KEYB3: D15.A K3.3(P) K3.4(P1) K8.3(P) K8.4(P1) K13.3(P) K13.4(P1) K18.3(P) K18.4(P1) K23.3(P) K23.4(P1) K28.3(P) K28.4(P1) R38.1 RN1.4 U$3.P$2 U$8.P$2 U$13.P$2 U$18.P$2 U$23.P$2 U$28.P$2 Z14.6(1A3)
KEYB4: D16.A K4.3(P) K4.4(P1) K7.3(P) K7.4(P1) K14.3(P) K14.4(P1) K17.3(P) K17.4(P1) K24.3(P) K24.4(P1) K27.3(P) K27.4(P1) R40.1 RN1.3 U$4.P$2 U$7.P$2 U$14.P$2 U$17.P$2 U$24.P$2 U$27.P$2 Z14.10(1A4)
KEYB5: D17.A K5.3(P) K5.4(P1) K6.3(P) K6.4(P1) K15.3(P) K15.4(P1) K16.3(P) K16.4(P1) K25.3(P) K25.4(P1) K26.3(P) K26.4(P1) K36.3(P) K36.4(P1) R41.1 RN1.2 U$5.P$2 U$6.P$2 U$15.P$2 U$16.P$2 U$25.P$2 U$26.P$2 U$36.P$2 Z14.12(2A1)
KM: K39.3(P) K39.4(P1) SJ2.1 U$39.P$2 Z40.2(I1)
KN: K38.3(P) K38.4(P1) SJ3.1 SJ6.1 U$38.P$2 Z40.3(I2)
KX: K34.3(P) K34.4(P1) SJ7.1 U$34.P$2 Z40.6(I5)
KZ: K33.3(P) K33.4(P1) SJ6.2 U$33.P$2 Z40.7(I6)
LINE: Z22.12(A:O) Z25.5(B:I0)
N$1: Z1-2.20(!CE) Z1-2.22(!OE!/VPP) Z22.8(C:O)
N$2: R32.2 R33.2 U2.4(IN-)
N$3: Z41.3(A:O) Z41.4(B:I0)
N$4: Z22.10(C:I1) Z29.14(Y1)
N$5: Z22.9(C:I0) Z29.15(Y0)
N$6: R26.1 Z26.2(A:I1) Z29.13(Y2)
N$7: Z7-8.20(!CE) Z24.3(A:I1) Z24.4(B:O)
N$8: Z14.1(1G) Z14.15(2G) Z23.2(A:I1) Z26.8(C:O)
N$9: JP3.1 Z29.12(Y3) Z31.3(B:I0)
N$10: Z19.3(A:O) Z20.4(B:I0)
N$11: Z20.5(B:I1) Z25.1(A:O)
N$12: Z19.4(B:I0) Z20.9(C:I0) Z22.6(B:O)
N$13: Z20.11(D:O) Z27.12(B:D)
N$14: Z20.8(C:O) Z27.11(B:CLK)
N$15: JP4.1 Z27.9(B:Q)
N$16: D1.A R3.S R4.A SJ1.2
N$17: Z23.13(D:I1) Z28.13(QH)
N$18: Z19.6(B:O) Z28.15(SH/!LD)
N$19: R200.2 Z7-8.11(DQ0) Z28.2(A)
N$20: R201.2 Z7-8.12(DQ1) Z28.3(B)
N$21: R202.2 Z7-8.13(DQ2) Z28.4(C)
N$22: R203.2 Z7-8.15(DQ3) Z28.5(D)
N$23: R204.2 Z7-8.16(DQ4) Z28.10(E)
N$24: R205.2 Z7-8.17(DQ5) Z28.11(F)
N$25: R206.2 Z7-8.18(DQ6) Z28.12(G)
N$26: R207.2 Z7-8.19(DQ7) Z28.14(H)
N$27: Z17.1(1G) Z17.15(2G) Z18.1(1G) Z23.6(B:O)
N$28: C3.2 R5.2 R7.1 Z18.14(2A2)
N$29: C3.1 EAR.TIP R6.2
N$30: Z5-6.20(!CE) Z23.4(B:I0) Z24.1(A:O)
N$31: Z5-6.22(!OE) Z7-8.22(!OE) Z30.3(A:O)
N$32: D12.C SJ9.2 Z40.19(O1)
N$33: R34.1 SJ1.1 X2.2 X2.2@2
N$34: Z41.6(B:O) Z41.10(C:I1)
N$35: Z1.11(B:CLK) Z41.8(C:O)
N$36: Z29.11(Y4) Z31.4(B:I1)
N$37: C4.2 R35.2 Z23.11(D:O)
N$38: JP3.2 Z3-4.20(!CE)
N$39: Z29.10(Y5) Z31.5(B:I2)
N$40: Z29.9(Y6) Z31.2(A:I1)
N$41: Z29.7(Y7) Z31.13(A:I2)
N$42: Z31.1(A:I0) Z31.6(B:O)
N$43: JP3.3 Z31.12(A:O)
N$44: JP4.3 Z27.8(B:!Q)
N$45: JP4.2 Z23.12(D:I0)
N$46: D16.C SJ4.2 Z40.15(O5)
N$47: R8.2 S1.3 Z1-2.27(A14)
N$48: R27.2 S1.4 Z1-2.26(A13)
N$49: Z25.8(C:I0) Z26.6(B:O) Z26.9(C:I0)
N$50: D14.C SJ2.2 Z40.17(O3)
N$51: D15.C SJ3.2 Z40.16(O4)
N$52: JP5.2 R11.1
N$53: JP15.6 R18.1
N$54: JP15.4 R17.1
N$55: JP15.2 R16.1
N$56: JP6.2 R42.1
N$58: D11.A Z16.13(2Y2)
N$59: D11.C R26.2 Z15.1(1G) Z15.15(2G) Z16.1(1G) Z16.14(2A2) Z24.2(A:I0) Z24.5(B:I0) Z26.13(D:I1)
N$60: Z23.3(A:O) Z24.12(D:I1)
N$61: Z24.8(C:I0) Z25.10(C:O) Z27.3(A:CLK)
N$63: Z24.10(C:O) Z24.11(D:I0)
N$64: R9.2 Z24.9(C:I1) Z24.13(D:O)
N$65: Q3.2(B) R9.1
N$70: R10.2 Z27.5(A:Q)
N$72: C6.2 R10.1
N$73: C5.1 C6.1 MIC.TIP
N$74: C5.2 D2.A LS1.- Q3.3(C)
N$75: C1.2 Q1.1(C) R1.2 R2.2 Z23.9(C:I0)
N$76: C1.1 X1.3
N$77: C2.1 Q1.2(B) R2.1 X1.1
N$78: Z20.1(A:I0) Z21.6(B:O) Z21.13(A:I2)
N$79: JP10.8 R15.1
N$80: Z11.2(A:CLR) Z11.12(B:CLR) Z20.3(A:O)
N$81: Z10.2(A:CLR) Z21.8(C:O)
N$83: Z22.2(A:I1) Z25.13(D:O)
N$86: Z1.9(B:Q) Z31.9(C:I0)
N$87: JP10.6 R14.1
N$88: JP10.4 R13.1
N$89: JP10.2 R12.1
N$90: JP15.8 R19.1
N$92: JP15.10 R20.1
N$101: D13.C SJ8.2 Z40.18(O2)
N$112: D17.C SJ5.2 Z40.14(O6)
N$115: R35.1 Z31.10(C:I1)
N$126: JP9.2 Z40.1(CLK)
N$129: LED1.A R28.2
N$131: LED2.A R29.1
N$133: JP7.2 POWER.TIP
N$142: R3.A Z31.8(C:O)
NC1: 24A.1(P)
NC2: 25A.1(P)
NC3: 24B.1(P)
NC4: 25B.1(P)
PHI: 5A.1(P) Z0.6(CLK) Z30.6(B:O)
RESET: 12B.1(P) C7.+ R25.1 S2.2(S) Z0.26(RESET)
ROW1: D10.A JP1.1 K31.1(S) K31.2(S1) K33.1(S) K33.2(S1) K34.1(S) K34.2(S1) K35.1(S) K35.2(S1) R30.2 SJ8.1 U$31.P$1 U$33.P$1 U$34.P$1 U$35.P$1 Z40.8(I7)
ROW2: D9.A JP1.2 K21.1(S) K21.2(S1) K22.1(S) K22.2(S1) K23.1(S) K23.2(S1) K24.1(S) K24.2(S1) K25.1(S) K25.2(S1) U$21.P$1 U$22.P$1 U$23.P$1 U$24.P$1 U$25.P$1
ROW3: D8.A JP1.3 K11.1(S) K11.2(S1) K12.1(S) K12.2(S1) K13.1(S) K13.2(S1) K14.1(S) K14.2(S1) K15.1(S) K15.2(S1) U$11.P$1 U$12.P$1 U$13.P$1 U$14.P$1 U$15.P$1
ROW4: D7.A JP1.4 K1.1(S) K1.2(S1) K2.1(S) K2.2(S1) K3.1(S) K3.2(S1) K4.1(S) K4.2(S1) K5.1(S) K5.2(S1) U$1.P$1 U$2.P$1 U$3.P$1 U$4.P$1 U$5.P$1
ROW5: D6.A JP1.5 K6.1(S) K6.2(S1) K7.1(S) K7.2(S1) K8.1(S) K8.2(S1) K9.1(S) K9.2(S1) K10.1(S) K10.2(S1) U$6.P$1 U$7.P$1 U$8.P$1 U$9.P$1 U$10.P$1
ROW6: D5.A JP1.6 K16.1(S) K16.2(S1) K17.1(S) K17.2(S1) K18.1(S) K18.2(S1) K19.1(S) K19.2(S1) K20.1(S) K20.2(S1) U$16.P$1 U$17.P$1 U$18.P$1 U$19.P$1 U$20.P$1
ROW7: D4.A JP1.7 K26.1(S) K26.2(S1) K27.1(S) K27.2(S1) K28.1(S) K28.2(S1) K29.1(S) K29.2(S1) K30.1(S) K30.2(S1) U$26.P$1 U$27.P$1 U$28.P$1 U$29.P$1 U$30.P$1
ROW8: D3.A JP1.8 K37.1(S) K37.2(S1) K38.1(S) K38.2(S1) K39.1(S) K39.2(S1) K40.1(S) K40.2(S1) K41.1(S) K41.2(S1) R31.2 SJ9.1 U$37.P$1 U$38.P$1 U$39.P$1 U$40.P$1 U$41.P$1 U$42.P$1 Z40.9(I8)
ROW_SS: D13.A K32.1(S) K32.2(S1) U$32.P$1
ROW_V: D12.A K36.1(S) K36.2(S1) U$36.P$1
S0000: R21.2 Z7-8.21(A0) Z18.9(1Y4)
S0001: R22.2 Z7-8.23(A1) Z18.7(1Y3)
S0002: R23.2 Z7-8.24(A2) Z18.5(1Y2)
SYNC: D1.C Z1.13(B:CLR) Z25.4(B:O)
VA0: 1A1.1(P) R11.2 Z5-6.21(A0) Z15.3(1Y1)
VA1: 9A1.1(P) R12.2 Z5-6.23(A1) Z15.5(1Y2)
VA2: 6B2.1(P) R13.2 Z5-6.24(A2) Z15.7(1Y3)
VA3: 1B1.1(P) R14.2 Z5-6.25(A3) Z15.9(1Y4)
VA4: 2A1.1(P) R15.2 Z5-6.26(A4) Z15.11(2Y1)
VA5: 2B1.1(P) R16.2 Z5-6.1(A5) Z15.13(2Y2)
VA6: 5B2.1(P) R17.2 Z5-6.2(A6) Z16.3(1Y1)
VA7: 8A1.1(P) R18.2 Z5-6.3(A7) Z16.5(1Y2)
VA8: 8B2.1(P) R19.2 Z5-6.4(A8) Z16.7(1Y3)
VA9: 9B1.1(P) R20.2 Z5-6.5(A9) Z16.9(1Y4)
VCC [power]: 4A.1(P) 11B1.1(P) C12.+ C13.2 C14.2 C15.2 C16.2 C17.2 C18.2 C19.2 C20.2 C21.2 D2.C JP8.1 JP8.2 JP9.1 LS1.+ R1.1 R3.E R7.2 R8.1 R24.2 R25.2 R27.1 R28.1 R30.1 R31.1 R36.2 R37.2 R38.2 R39.2 R40.2 R41.2 RN1.1 U1.3(VO) U2.5(VCC) Z0.11(VCC) Z1-2.28(VCC) Z1.10(B:PRE) Z1.12(B:D) Z16.12(2A1) Z18.12(2A1) Z19.13(D:I1) Z22.11(C:I2) Z23.1(A:I0) Z23.5(B:I1) Z27.1(A:CLR) Z27.4(A:PRE) Z27.10(B:PRE) Z27.13(B:CLR) Z28.9(CLR) Z29.6(G1) Z31.11(C:I2) Z40.20(VCC) Z41.1(A:I0) Z41.9(C:I0)
VD0: 5A1.1(P) R100.2 Z5-6.11(DQ0) Z7-8.25(A3) Z18.3(1Y1)
VD1: 4B2.1(P) R101.2 Z5-6.12(DQ1) Z7-8.26(A4) Z17.13(2Y2)
VD2: 3B1.1(P) R102.2 Z5-6.13(DQ2) Z7-8.1(A5) Z17.11(2Y1)
VD3: 3A1.1(P) R103.2 Z5-6.15(DQ3) Z7-8.2(A6) Z17.9(1Y4)
VD4: 4A1.1(P) R104.2 Z5-6.16(DQ4) Z7-8.3(A7) Z17.7(1Y3)
VD5: 7A1.1(P) R105.2 Z5-6.17(DQ5) Z7-8.4(A8) Z17.5(1Y2)
VD6: 10B1.1(P) R106.2 Z5-6.18(DQ6) Z7-8.5(A9) Z17.3(1Y1)
VD7: 6A1.1(P) R107.2 Z5-6.19(DQ7) Z20.13(D:I1)
VIDEN: Z19.5(B:I1) Z19.10(C:I1) Z20.6(B:O) Z20.12(D:I0)
VIDEO: 13B1.1(P) 14B1.1(P) 15B1.1(P)
Unconnected: 10A1.1(P) EAR.SW(SWITCH) JP7.3 MIC.SW(SWITCH) POWER.SW(SWITCH) Z1.5(A:Q) Z1.6(A:!Q) Z1.8(B:!Q) Z9.8(B:QD) Z9.9(B:QC) Z9.10(B:QB) Z10.8(B:QD) Z11.8(B:QD) Z11.9(B:QC) Z16.11(2Y1) Z18.11(2Y1) Z27.6(A:!Q) Z40.11(OE) Z40.12(O8) Z40.13(O7) Z41.11(D:O)

## Buses
ADDRESS:A0,A1,A2,A3,A4,A5,A6,A7,A8,A9,A10,A11,A12,A13,A14,A15
DATA:D0,D1,D2,D3,D4,D5,D6,D7

## Notes on the sheet
- BACKPORCH
  GENERATOR
- BLACK | WHITE
- OPTIONAL 
  WITHOUT MAX4390
- CHAR SET
- BG MAP
- 3KB | 19KB
- WORK RAM
- 8 x 1K | 8 x 1K
- FORCE81
- AUTO

## Power pins joined to a net without a drawn wire
GND: Z1.7(P:GND) Z3-4.14(GND) Z5-6.14(GND) Z7-8.14(GND) Z9.7(P:GND) Z10.7(P:GND) Z11.7(P:GND) Z14.8(GND) Z15.8(GND) Z16.8(GND) Z17.8(GND) Z18.8(GND) Z19.7(P:GND) Z20.7(P:GND) Z21.7(P:GND) Z22.7(P:GND) Z23.7(P:GND) Z24.7(P:GND) Z25.7(P:GND) Z26.7(P:GND) Z27.7(P:GND) Z28.8(GND) Z29.8(GND) Z30.7(P:GND) Z31.7(P:GND) Z41.7(P:GND)
VCC: Z1.14(P:VCC) Z3-4.28(VCC) Z5-6.28(VCC) Z7-8.28(VCC) Z9.14(P:VCC) Z10.14(P:VCC) Z11.14(P:VCC) Z14.16(VCC) Z15.16(VCC) Z16.16(VCC) Z17.16(VCC) Z18.16(VCC) Z19.14(P:VCC) Z20.14(P:VCC) Z21.14(P:VCC) Z22.14(P:VCC) Z23.14(P:VCC) Z24.14(P:VCC) Z25.14(P:VCC) Z26.14(P:VCC) Z27.14(P:VCC) Z28.16(VCC) Z29.16(VCC) Z30.14(P:VCC) Z31.14(P:VCC) Z41.14(P:VCC)

## Library data of the parts
1A 1A1 1B 1B1 2A 2A1 2B 2B1 3A 3A1 3B 3B1 4A 4A1 4B 4B2 5A 5A1 5B 5B2 6A 6A1 6B 6B2 7A 7A1 7B 7B2 8A 8A1 8B 8B2 9A 9A1 9B 9B1 10A 10A1 10B 10B1 11A 11A1 11B 11B1 12A 12B 13A 13A1 13B 13B1 14A 14A1 14B 14B1 15A 15A1 15B 15B1 16A 16B 17A 17B 18A 18B 19A 19B 20A 20B 21A 21B 22A 22B 24A 24B 25A 25B 26A 26B 27A 27B 28A 28B = wirepad:SMD2: SMD PAD
C1-C6 C8 C10 C13-C22 = rcl:C-EU: CAPACITOR, European symbol; SPICEPREFIX: C
C7 C9 C11 C12 = rcl:CPOL-EU: POLARIZED CAPACITOR, European symbol; SPICEPREFIX: C
D1-D17 = diode:1N4148: DIODE high speed (Philips)
EAR MIC POWER = pj302m:PJ302M: PJ302M horizontal / right angled mount 3.5 mm jack socket
JP1 = pinhead:PINHD-1X8: PIN HEADER
JP3 = jumper:JP2E: JUMPER
JP4 JP7 JP9 = pinhead:PINHD-1X3: PIN HEADER
JP5 JP6 JP8 = jumper:JP1E: JUMPER
JP10 = jumper:JP4QE: JUMPER
JP15 = jumper:JP5QE: JUMPER
K1-K41 = switch-omron:40-XX: OMRON SWITCH
LED1 LED2 = led:LED: LED OSRAM: - CHIPLED LG R971, LG N971, LY N971, LG Q971, LY Q971, LO R971, LY R971 LH N974, LH R974 LS Q976, LO Q976, LY Q976 LO Q996 - Hyper CHIPLED LW Q18S LB Q993, LB Q99A, LB R99A - SideLED LS A670, LO A670, LY A670, LG A670, LP A670 LB A673, LV A673, LT A673, LW A673 LH A674 LY A675 LS A676, LA A676, LO A676, LY A676, LW A676 LS A679, LY A679, LG A679 - Hyper Micro SIDELED® LS Y876, LA Y876, LO Y876, LY Y876 LT Y87S - SmartLED LW L88C, LW L88S LB L89C, LB L89S, LG L890 LS L89K, LO L89K, LY L89K LS L896, LA L896, LO L896, LY L896 - TOPLED LS T670, LO T670, LY T670, LG T670, LP T670 LSG T670, LSP T670, LSY T670, LOP T670, LYG T670 LG T671, LOG T671, LSG T671 LB T673, LV T673, LT T673, LW T673 LH T674 LS T676, LA T676, LO T676, LY T676, LB T676, LH T676, LSB T676, LW T676 LB T67C, LV T67C, LT T67C, LS T67K, LO T67K, LY T67K, LW E67C LS E67B, LA E67B, LO E67B, LY E67B, LB E67C, LV E67C, LT E67C LW T67C LS T679, LY T679, LG T679 LS T770, LO T770, LY T770, LG T770, LP T770 LB T773, LV T773, LT T773, LW T773 LH T774 LS E675, LA E675, LY E675, LS T675 LS T776, LA T776, LO T776, LY T776, LB T776 LHGB T686 LT T68C, LB T68C - Hyper Mini TOPLED® LB M676 - Mini TOPLED Santana® LG M470 LS M47K, LO M47K, LY M47K Source: http://www.osram.convergy.de LUXEON: - LUMILED® LXK2-PW12-R00, LXK2-PW12-S00, LXK2-PW14-U00, LXK2-PW14-V00 LXK2-PM12-R00, LXK2-PM12-S00, LXK2-PM14-U00 LXK2-PE12-Q00, LXK2-PE12-R00, LXK2-PE12-S00, LXK2-PE14-T00, LXK2-PE14-U00 LXK2-PB12-K00, LXK2-PB12-L00, LXK2-PB12-M00, LXK2-PB14-N00, LXK2-PB14-P00, LXK2-PB14-Q00 LXK2-PR12-L00, LXK2-PR12-M00, LXK2-PR14-Q00, LXK2-PR14-R00 LXK2-PD12-Q00, LXK2-PD12-R00, LXK2-PD12-S00 LXK2-PH12-R00, LXK2-PH12-S00 LXK2-PL12-P00, LXK2-PL12-Q00, LXK2-PL12-R00 Source: www.luxeon.com KINGBRIGHT: KA-3528ASYC Source: www.kingbright.com
LS1 = buzzer:F/QMX: BUZZER Source: Buerklin; OC_FARNELL: unknown; OC_NEWARK: unknown
Q1 = transistor:2N3904: NPN TRANSISTOR
Q3 = transistor:BC337: NPN TRANSISTOR
R1 R2 R5-R42 = rcl:R-EU_: RESISTOR, European symbol; SPICEPREFIX: R
R3 R4 = pot:TRIM_EU-: POTENTIOMETER
R100-R107 R200-R207 = rcl:R-US_: RESISTOR, American symbol; SPICEPREFIX: R
RN1 = resistor-net:RN05: RESISTOR NETWORK; OC_FARNELL: unknown; OC_NEWARK: unknown
S1 = switch-dil:DS02: DIL/CODE SWITCH; OC_FARNELL: 9472126; OC_NEWARK: unknown
S2 = switch-omron:31-XX: OMRON SWITCH; MPN: B3F-3100; OC_FARNELL: 959704; OC_NEWARK: 36M3582
SJ1-SJ9 = jumper:SJ: SMD solder JUMPER
U1 = linear:78*: Positive VOLTAGE REGULATOR Source: http://cache.national.com/ds/LM/LM78L05.pdf http://www.fairchildsemi.com/ds/LM/LM7805.pdf
U2 = MAX4390EUK:MAX4390EUK: Check availability <https://pricing.snapeda.com/parts/MAX4390EUK%2BT/Maxim%20Integrated/view-part?ref=eda>; AVAILABILITY: In Stock; DESCRIPTION: OP Amp Single Volt Fdbk R-R O/P Â±5.5V/11V 5-Pin SOT-23 T/R; MF: Maxim Integrated; MP: MAX4390EUK+T; PACKAGE: SOT-23-5 Maxim Integrated; PRICE: None; PURCHASE-URL: https://pricing.snapeda.com/search/part/MAX4390EUK+T/?ref=eda
U$1-U$42 = switch-omron:40-XX-CARBON
X1 = crystal:8M10AHC49T: Monolithic Crystal Filters Source: www.vanlong.com; OC_FARNELL: unknown; OC_NEWARK: unknown
X2 = Jupiter Ace build013:CON-CONRAD_736880-49: Cinch Connector ( RCA Jack )
Z0 = zilog:Z80CPU: Z80 FAMILY DEVICE
Z1 Z27 = 74xx-eu:74*74: Dual D type positive edge triggered FLIP FLOP, preset and clear
Z1-2 = memory-hitachi:27512G: MEMORY; OC_FARNELL: unknown; OC_NEWARK: unknown
Z3-4 Z5-6 Z7-8 = memory-sram:CY62256LL-?*: 256K (32K x 8) CMOS-Static RAM Source: http://download.cypress.com.edgesuite.net/design_resources/datasheets/contents/cy62256_8.pdf
Z9-Z11 = 74xx-eu:74*393: Dual 4-bit decade and binary COUNTER
Z14-Z18 = 74xx-eu:74*367: Hex BUS DRIVER, 3-state
Z19 Z30 Z41 = 74xx-eu:74*00: Quad 2-input NAND gate
Z20 = 74xx-eu:74*08: Quad 2-input AND gate
Z21 Z22 Z31 = 74xx-eu:74*11: Triple 3-input AND gate
Z23 = 74xx-eu:74*86: Quad 2-input EXCLUSIVE-OR (XOR) gate
Z24 Z25 = 74xx-eu:74*02: Quad 2-input NOR gate
Z26 = 74xx-eu:74*32: Quad 2-input OR gate
Z28 = 74xx-eu:74*166: 8-bit parallel load SHIFT REGISTER
Z29 = 74xx-eu:74*138: 3-line to 8-line DECODER/DEMULTIPLEXER
Z40 = atmel:ATF16V8B: High perfomance CMOS (electrically erasable) programmable logic device (PLD) ABLE-Atmel-ABEL - P18V8R, P16V8C, P16V8AS, P17V8 COPL Atmel-WinCUPL - G16V8MS, G16V8MA, G16V8AS, G16V8 LOG/IC - GAL16V8_R, GAL16V8_G7, GAL16V8_C), GAL16V8 Tango-PLD - G16V8R, G16V8C, G16V8AS, G16V8 Source: http://www.atmel.com/dyn/resources/prod_documents/DOC0364.PDF; MPN: ATF16V8CZ-15PU; OC_FARNELL: 1551768; OC_NEWARK: 94M6254

## Net classes
0 default: width 0.1 mm
1 power: width 0.4 mm